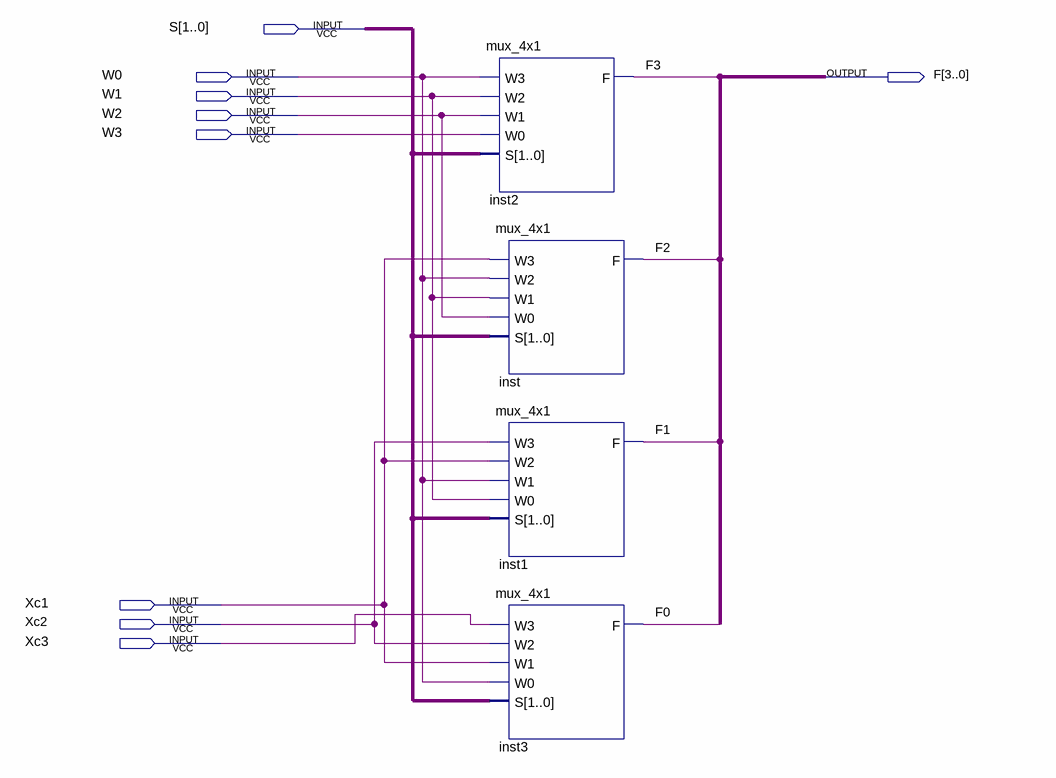
[diagram p0: schematic sheet]
// Quartus schematic lab08.bdf as structural Verilog: 4 symbols, 9 pins
module lab08 (
  input  [1:0] S,
  input  W0,
  input  W1,
  input  W2,
  input  W3,
  input  Xc1,
  input  Xc2,
  input  Xc3,
  output [3:0] F
);

  mux_4x1 inst2 (.W3(W0), .W2(W1), .W1(W2), .W0(W3), .S(S), .F(F[3]));
  mux_4x1 inst (.W3(Xc1), .W2(W0), .W1(W1), .W0(W2), .S(S), .F(F[2]));
  mux_4x1 inst1 (.W3(Xc2), .W2(Xc1), .W1(W0), .W0(W1), .S(S), .F(F[1]));
  mux_4x1 inst3 (.W3(Xc3), .W2(Xc2), .W1(Xc1), .W0(W0), .S(S), .F(F[0]));
endmodule
